# EasyEDA schematic SCH_pave_2026-02-10.json
TITLE: Sheet_1; REV: 1.0; Date: 2026-01-11; Sheet: 1/1; Drawn By: ludoguillain; Company: Your Company
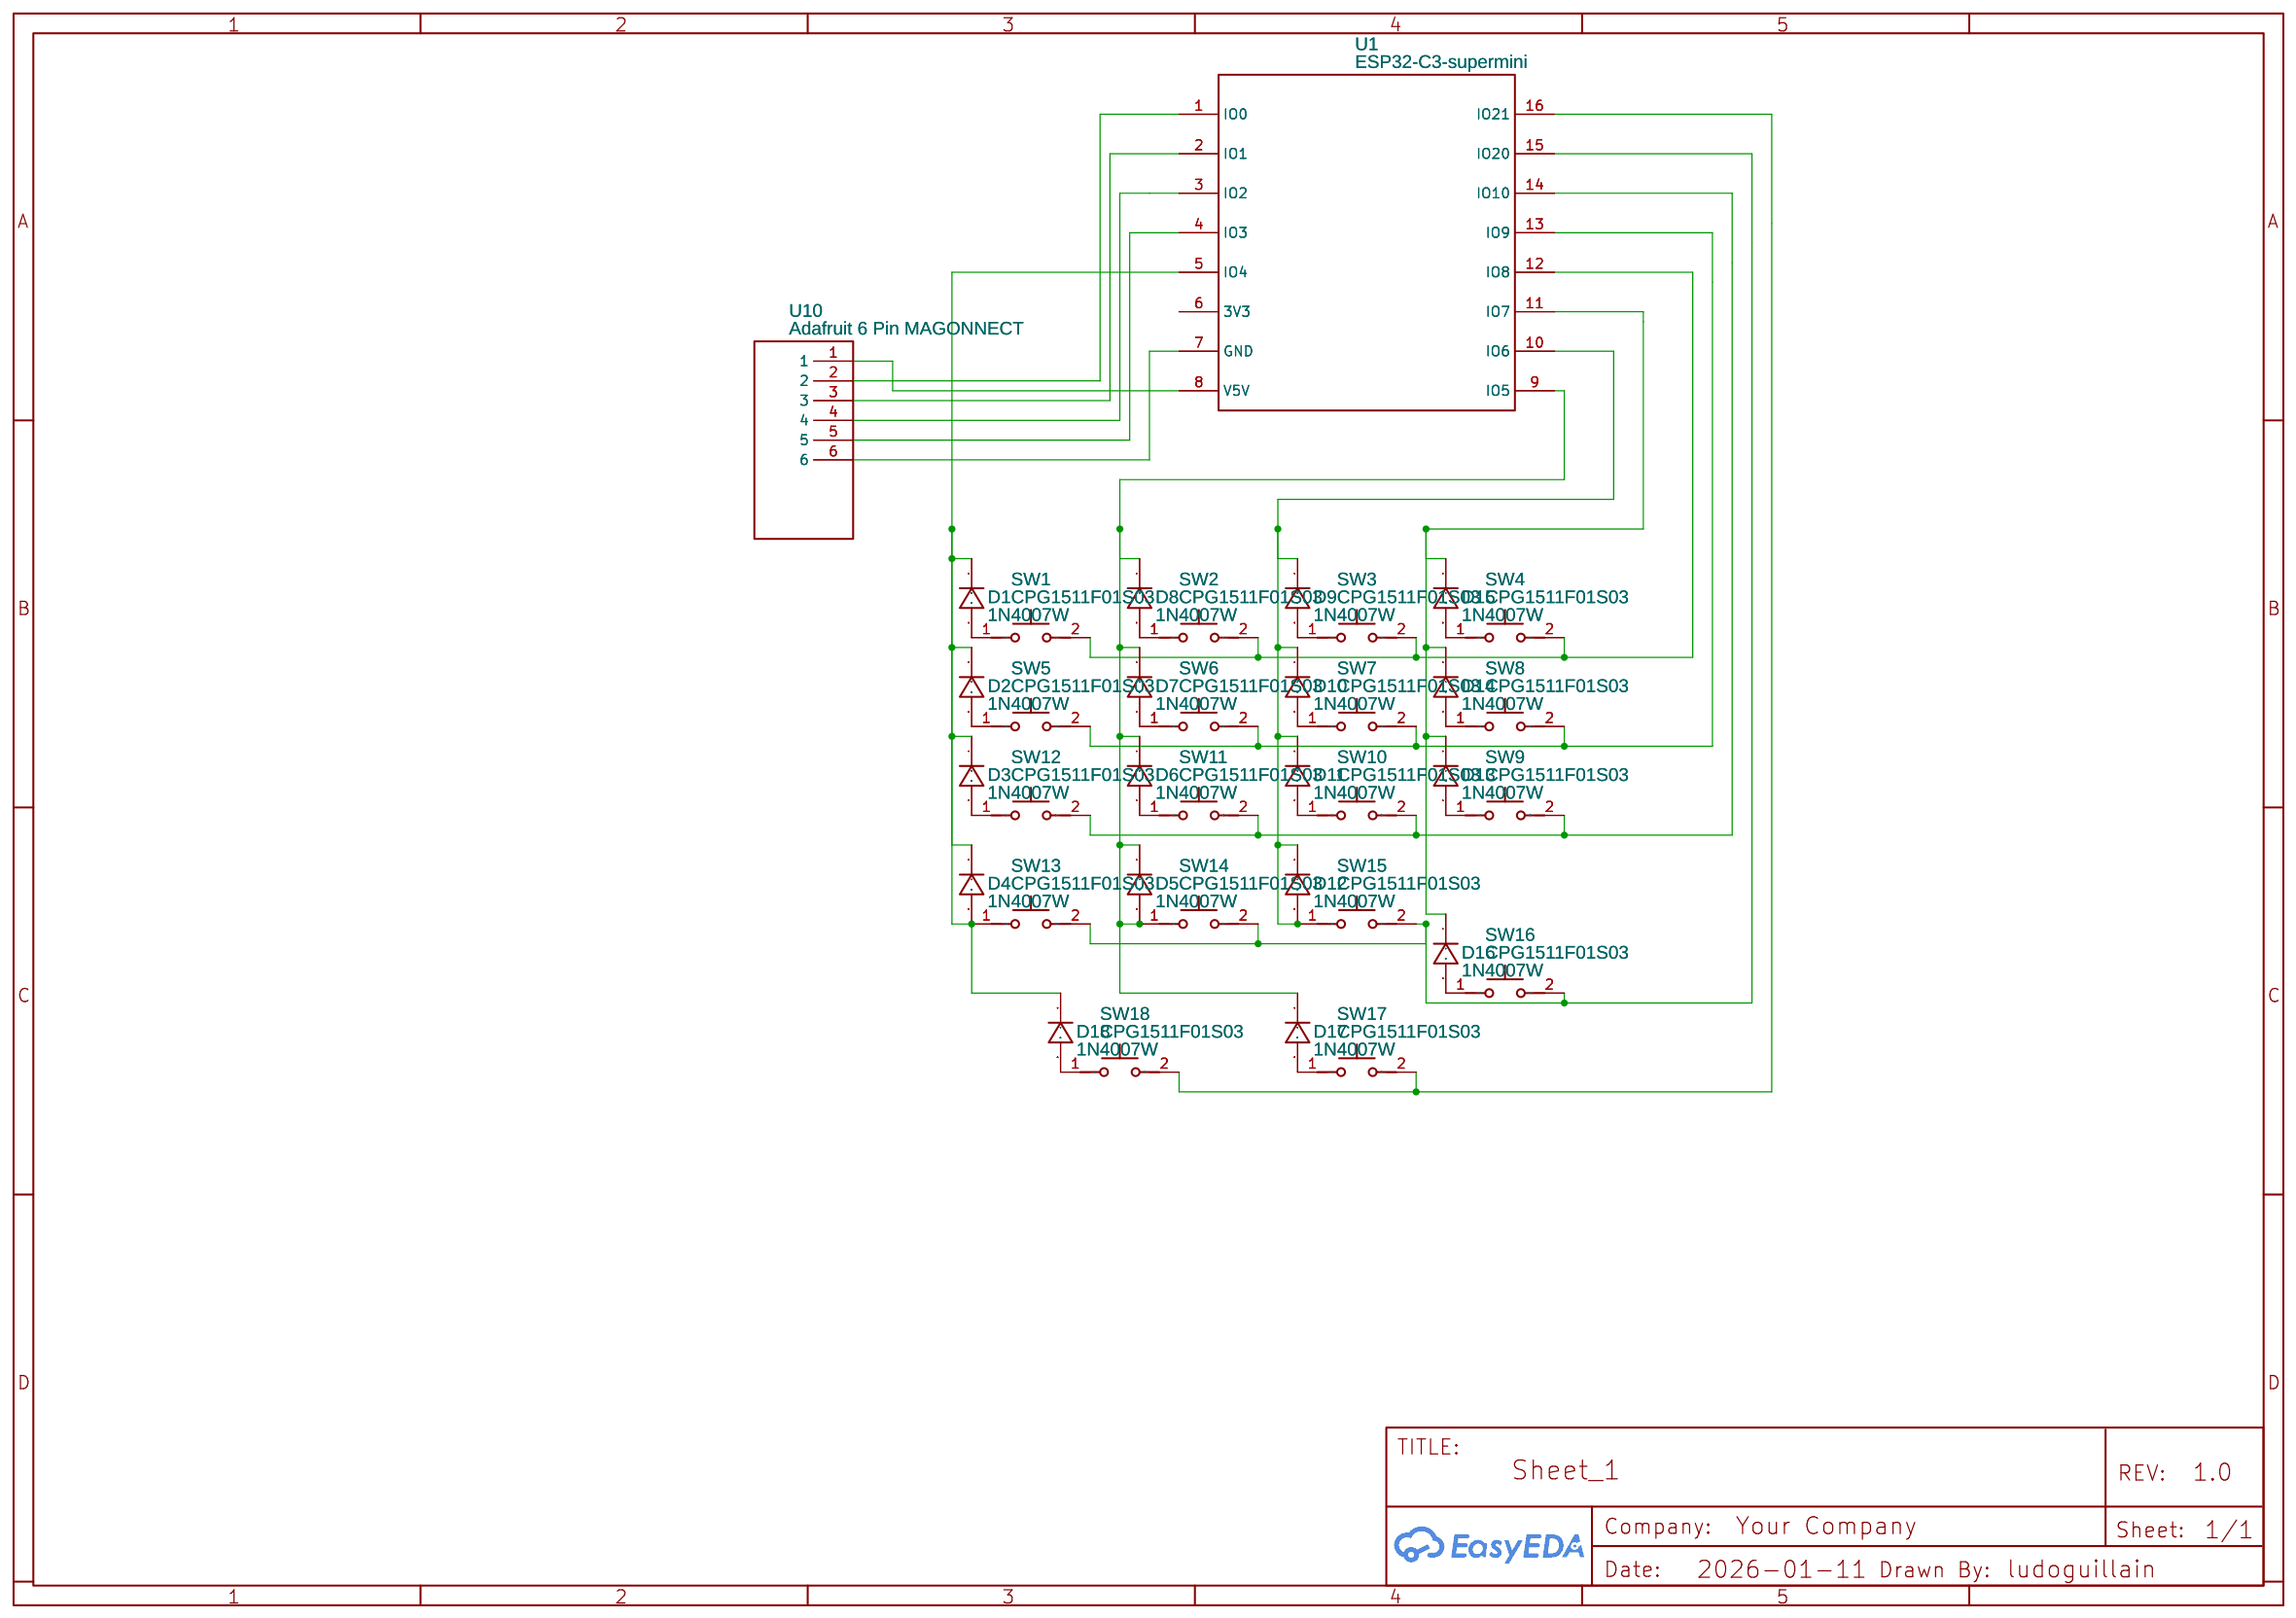
[diagram p0: schematic sheet]

## Parts
D1  1N4007W  [SOD-123_L2.8-W1.8-LS3.7-RD]
D2  1N4007W  [SOD-123_L2.8-W1.8-LS3.7-RD]
D3  1N4007W  [SOD-123_L2.8-W1.8-LS3.7-RD]
D4  1N4007W  [SOD-123_L2.8-W1.8-LS3.7-RD]
D5  1N4007W  [SOD-123_L2.8-W1.8-LS3.7-RD]
D6  1N4007W  [SOD-123_L2.8-W1.8-LS3.7-RD]
D7  1N4007W  [SOD-123_L2.8-W1.8-LS3.7-RD]
D8  1N4007W  [SOD-123_L2.8-W1.8-LS3.7-RD]
D9  1N4007W  [SOD-123_L2.8-W1.8-LS3.7-RD]
D10  1N4007W  [SOD-123_L2.8-W1.8-LS3.7-RD]
D11  1N4007W  [SOD-123_L2.8-W1.8-LS3.7-RD]
D12  1N4007W  [SOD-123_L2.8-W1.8-LS3.7-RD]
D13  1N4007W  [SOD-123_L2.8-W1.8-LS3.7-RD]
D14  1N4007W  [SOD-123_L2.8-W1.8-LS3.7-RD]
D15  1N4007W  [SOD-123_L2.8-W1.8-LS3.7-RD]
D16  1N4007W  [SOD-123_L2.8-W1.8-LS3.7-RD]
D17  1N4007W  [SOD-123_L2.8-W1.8-LS3.7-RD]
D18  1N4007W  [SOD-123_L2.8-W1.8-LS3.7-RD]
SW1  CPG1511F01S03  [KEY-TH_CPG1511F01S0X]
SW2  CPG1511F01S03  [KEY-TH_CPG1511F01S0X]
SW3  CPG1511F01S03  [KEY-TH_CPG1511F01S0X]
SW4  CPG1511F01S03  [KEY-TH_CPG1511F01S0X]
SW5  CPG1511F01S03  [KEY-TH_CPG1511F01S0X]
SW6  CPG1511F01S03  [KEY-TH_CPG1511F01S0X]
SW7  CPG1511F01S03  [KEY-TH_CPG1511F01S0X]
SW8  CPG1511F01S03  [KEY-TH_CPG1511F01S0X]
SW9  CPG1511F01S03  [KEY-TH_CPG1511F01S0X]
SW10  CPG1511F01S03  [KEY-TH_CPG1511F01S0X]
SW11  CPG1511F01S03  [KEY-TH_CPG1511F01S0X]
SW12  CPG1511F01S03  [KEY-TH_CPG1511F01S0X]
SW13  CPG1511F01S03  [KEY-TH_CPG1511F01S0X]
SW14  CPG1511F01S03  [KEY-TH_CPG1511F01S0X]
SW15  CPG1511F01S03  [KEY-TH_CPG1511F01S0X]
SW16  CPG1511F01S03  [KEY-TH_CPG1511F01S0X]
SW17  CPG1511F01S03  [KEY-TH_CPG1511F01S0X]
SW18  CPG1511F01S03  [KEY-TH_CPG1511F01S0X]
U1  ESP32-C3-supermini  [ESP32-C3-SUPERMINI]
U10  Adafruit 6 Pin MAGONNECT  [MAGNETIC CONNECTOR 9PIN]

## Library data of the parts
D1-D18 = 1N4007W: Supplier: LCSC; Supplier Part: C328592; Manufacturer: BLUE ROCKET; Contributor: LCEDA_Lib
SW1-SW18 = CPG1511F01S03: Contributor: LCSC; Supplier: LCSC; Supplier Part: C400227; Manufacturer: Kailh(凯华); JLCPCB Part Class: Extended Part
U1 = ESP32-C3-supermini: Contributor: Guest
U10 = Adafruit 6 Pin MAGONNECT: Contributor: rmccullough3000

## Nets
Net-(D1-1): D1.1 D2.1 D3.1 D4.1 D4.2 D18.1 SW13.1 U1.5(IO4)
Net-(D1-2): D1.2 SW1.1
Net-(D2-2): D2.2 SW5.1
Net-(D3-2): D3.2 SW12.1
Net-(D5-1): D5.1 D5.2 D6.1 D7.1 D8.1 D17.1 SW14.1 U1.9(IO5)
Net-(D6-2): D6.2 SW11.1
Net-(D7-2): D7.2 SW6.1
Net-(D8-2): D8.2 SW2.1
Net-(D9-1): D9.1 D10.1 D11.1 D12.1 D12.2 SW15.1 U1.10(IO6)
Net-(D9-2): D9.2 SW3.1
Net-(D10-2): D10.2 SW7.1
Net-(D11-2): D11.2 SW10.1
Net-(D13-1): D13.1 D14.1 D15.1 D16.1 U1.11(IO7)
Net-(D13-2): D13.2 SW9.1
Net-(D14-2): D14.2 SW8.1
Net-(D15-2): D15.2 SW4.1
Net-(D16-2): D16.2 SW16.1
Net-(D17-2): D17.2 SW17.1
Net-(D18-2): D18.2 SW18.1
Net-(SW1-2): SW1.2 SW2.2 SW3.2 SW4.2 U1.12(IO8)
Net-(SW5-2): SW5.2 SW6.2 SW7.2 SW8.2 U1.13(IO9)
Net-(SW9-2): SW9.2 SW10.2 SW11.2 SW12.2 U1.14(IO10)
Net-(SW13-2): SW13.2 SW14.2 SW15.2 SW16.2 U1.15(IO20)
Net-(SW17-2): SW17.2 SW18.2 U1.16(IO21)
Net-(U1-1): U1.1(IO0) U10.2
Net-(U1-2): U1.2(IO1) U10.3
Net-(U1-3): U1.3(IO2) U10.4
Net-(U1-4): U1.4(IO3) U10.5
Net-(U1-7): U1.7(GND) U10.6
Net-(U1-8): U1.8(V5V) U10.1

Not connected (* = marked no-connect by the designer): U1 6(3V3)
